# EAGLE design laser (EAGLE 9.6.2)

## Sheet 1 of 2
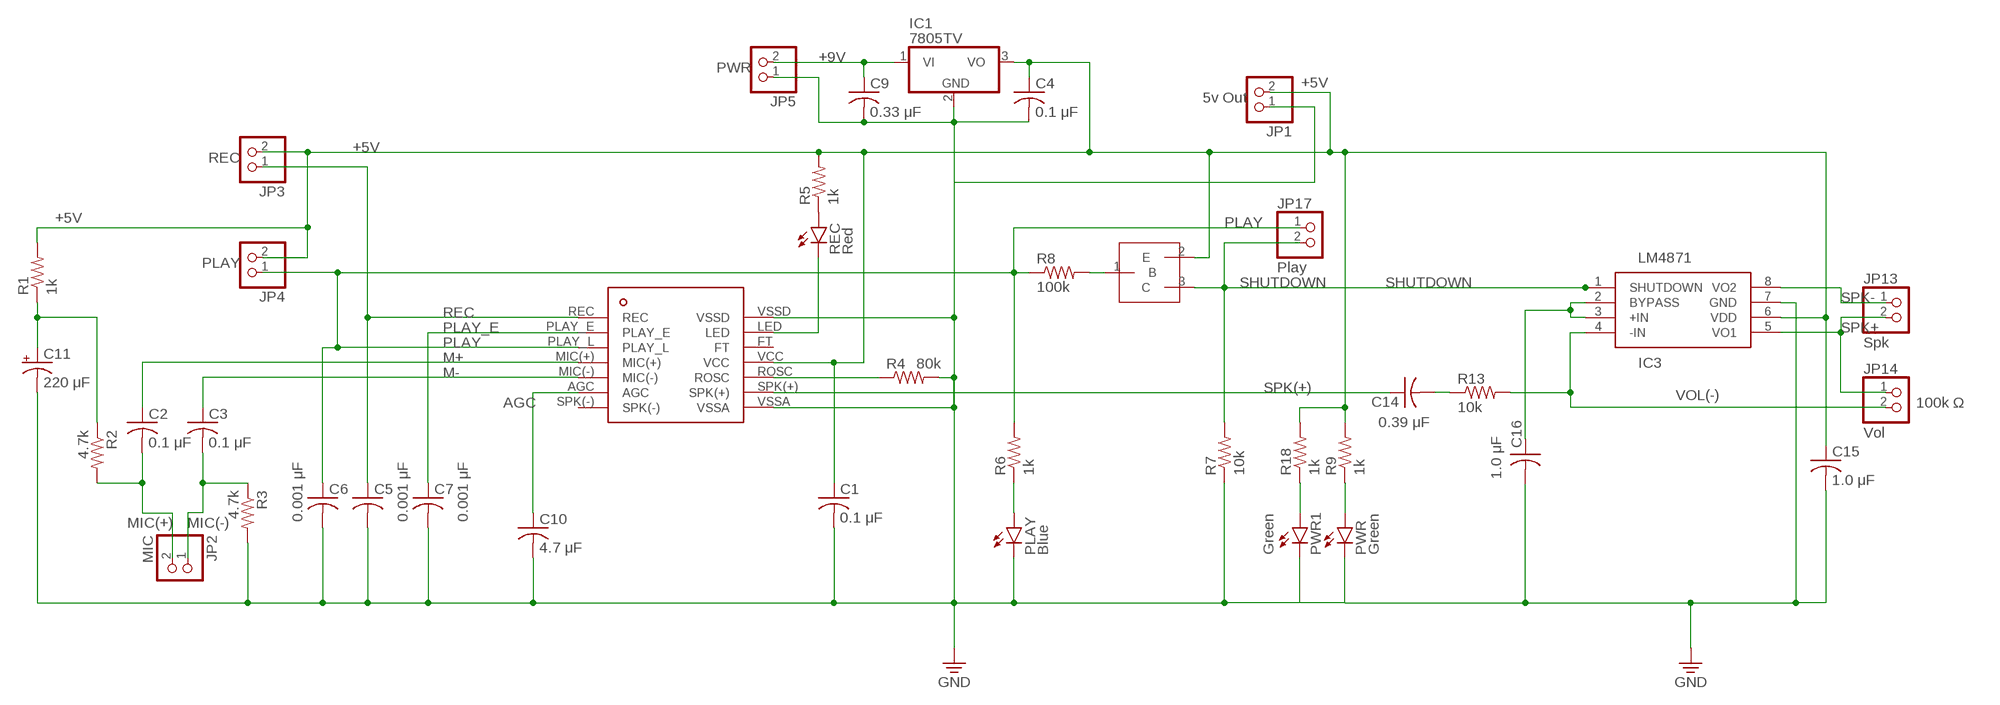
[diagram p0: schematic, sheet 1]

### Parts
C1  0.1 μF  C-USC0805  [C0805]
C2  0.1 μF  C-USC0805  [C0805]
C3  0.1 μF  C-USC0805  [C0805]
C4  0.1 μF  C-USC0805  [C0805]
C5  0.001 μF  C-USC0805  [C0805]
C6  0.001 μF  C-USC0805  [C0805]
C7  0.001 μF  C-USC0805  [C0805]
C9  0.33 μF  C-USC0805  [C0805]
C10  4.7 μF  C-USC0805  [C0805]
C11  220 μF  CPOL-USE2.5-5  [E2,5-5]
C14  0.39 μF  C-USC0805  [C0805]
C15  1.0 μF  C-USC0805  [C0805]
C16  1.0 μF  C-USC0805  [C0805]
IC1  7805TV  [TO220V]
IC3  LM4871  LM4871MX_NOPB  [SOIC127P600X175-8N]
JP1  5v Out  PINHD-1X2  [1X02]
JP2  MIC  PINHD-1X2  [1X02]
JP3  REC  PINHD-1X2  [1X02]
JP4  PLAY  PINHD-1X2  [1X02]
JP5  PWR  PINHD-1X2  [1X02]
JP13  Spk  PINHD-1X2  [1X02]
JP14  Vol  PINHD-1X2  [1X02]
JP17  Play  PINHD-1X2  [1X02]
PLAY  Blue  LEDCHIP-LED0805  [CHIP-LED0805]
PWR  Green  LEDCHIP-LED0805  [CHIP-LED0805]
PWR1  Green  LEDCHIP-LED0805  [CHIP-LED0805]
R1  1k  R-US_R0805  [R0805]
R2  4.7k  R-US_R0805  [R0805]
R3  4.7k  R-US_R0805  [R0805]
R4  80k  R-US_R0805  [R0805]
R5  1k  R-US_R0805  [R0805]
R6  1k  R-US_R0805  [R0805]
R7  10k  R-US_R0805  [R0805]
R8  100k  R-US_R0805  [R0805]
R9  1k  R-US_R0805  [R0805]
R13  10k  R-US_R0805  [R0805]
R18  1k  R-US_R0805  [R0805]
REC  Red  LEDCHIP-LED0805  [CHIP-LED0805]
U$1  ISD1820PY  [ISD1820PY]
U$2  PNP  2PB709ARL,235  [SOT95P230X110-3N]

### Nets
+5V: C1.1 C4.1 C15.1 IC1.3(VO) IC3.6(VDD) JP1.2 JP3.2 JP4.2 R1.2 R5.2 R9.2 R18.2 U$1.VCC U$2.2(E)
+9V: C9.1 IC1.1(VI) JP5.2
AGC: C10.1 U$1.AGC
GND: C1.2 C4.2 C5.2 C6.2 C7.2 C9.2 C10.2 C11.- C15.2 C16.2 IC1.2(GND) IC3.7(GND) JP1.1 JP5.1 PLAY.C PWR.C R3.2 R4.2 R7.1 U$1.VSSA U$1.VSSD ; also sheet 2
GND1: PWR1.C
M+: C2.1 U$1.MIC(+)
M-: C3.1 U$1.MIC(-)
MIC(+): C2.2 JP2.2 R2.2
MIC(-): C3.2 JP2.1 R3.1
N$1: PLAY.A R6.1
N$2: PWR.A R9.1
N$3: R8.2 U$2.1(B)
N$4: C14.2 R13.1
N$6: R4.1 U$1.ROSC
N$7: C16.1 IC3.2(BYPASS) IC3.3(+IN)
N$12: PWR1.A R18.1
N$13: C11.+ R1.1 R2.1
N$15: R5.1 REC.A
N$17: REC.C U$1.LED
PLAY: C6.1 JP4.1 JP17.1 R6.2 R8.1 U$1.PLAY_L ; also sheet 2
PLAY_E: C7.1 U$1.PLAY_E
REC: C5.1 JP3.1 U$1.REC
SHUTDOWN: IC3.1(SHUTDOWN) JP17.2 R7.2 U$2.3(C)
SPK(+): C14.1 U$1.SPK(+)
SPK+: IC3.5(VO1) JP13.2 JP14.1
SPK-: IC3.8(VO2) JP13.1
VOL(-): IC3.4(-IN) JP14.2 R13.2
Unconnected: U$1.FT U$1.SPK(-)

### Notes on the sheet
- 100k Ω ├

## Sheet 2 of 2
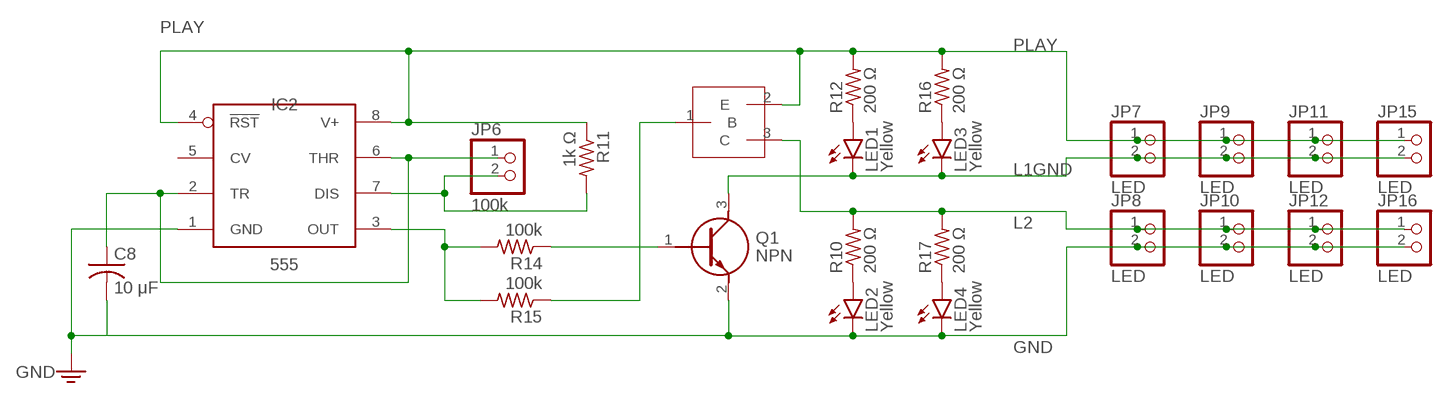
[diagram p1: schematic, sheet 2]

### Parts
C8  10 μF  C-US_CHIP-0805(2012-METRIC)  [CAPC2012X110]
IC2  555  NE555_SOIC  [SOIC127P599X175-8N]
JP6  100k  PINHD-1X2  [1X02]
JP7  LED  PINHD-1X2  [1X02]
JP8  LED  PINHD-1X2  [1X02]
JP9  LED  PINHD-1X2  [1X02]
JP10  LED  PINHD-1X2  [1X02]
JP11  LED  PINHD-1X2  [1X02]
JP12  LED  PINHD-1X2  [1X02]
JP15  LED  PINHD-1X2  [1X02]
JP16  LED  PINHD-1X2  [1X02]
LED1  Yellow  LEDCHIP-LED0805  [CHIP-LED0805]
LED2  Yellow  LEDCHIP-LED0805  [CHIP-LED0805]
LED3  Yellow  LEDCHIP-LED0805  [CHIP-LED0805]
LED4  Yellow  LEDCHIP-LED0805  [CHIP-LED0805]
Q1  NPN  PMBT2222A,215  [PMBT2222A215]
R10  200 Ω  R-US_M0805  [M0805]
R11  1k Ω  R-US_M0805  [M0805]
R12  200 Ω  R-US_M0805  [M0805]
R14  100k  R-US_M0805  [M0805]
R15  100k  R-US_M0805  [M0805]
R16  200 Ω  R-US_M0805  [M0805]
R17  200 Ω  R-US_M0805  [M0805]
U$3  PNP  2PB709ARL,235  [SOT95P230X110-3N]

### Nets
GND: C8.2 IC2.1(GND) JP8.2 JP10.2 JP12.2 JP16.2 LED2.C LED4.C Q1.2(E) ; also sheet 1
L1GND: JP7.2 JP9.2 JP11.2 JP15.2 LED1.C LED3.C Q1.3(C)
L2: JP8.1 JP10.1 JP12.1 JP16.1 R10.2 R17.2 U$3.3(C)
N$8: LED1.A R12.1
N$10: LED3.A R16.1
N$11: LED4.A R17.1
N$14: LED2.A R10.1
N$201: C8.1 IC2.2(TR) IC2.6(THR) JP6.1
N$202: IC2.3(OUT) R14.2 R15.2
N$203: Q1.1(B) R14.1
N$205: IC2.7(DIS) JP6.2 R11.2
N$208: R15.1 U$3.1(B)
PLAY: IC2.4(!RST) IC2.8(V+) JP7.1 JP9.1 JP11.1 JP15.1 R11.1 R12.2 R16.2 U$3.2(E) ; also sheet 1
Unconnected: IC2.5(CV)

## Library data of the parts
C1-C7 C9 C10 C14-C16 = rcl:C-US: CAPACITOR, American symbol; SPICEPREFIX: C
C8 = Capacitor:C-US: Capacitor - ANSI; CATEGORY: Capacitor
C11 = adafruit:CPOL-US: POLARIZED CAPACITOR, American symbol
IC1 = linear:78*: Positive VOLTAGE REGULATOR Source: http://cache.national.com/ds/LM/LM78L05.pdf http://www.fairchildsemi.com/ds/LM/LM7805.pdf
IC2 = IC_Clock-Timing:*555: TIMER 555 General purpose precision timers NE555 : Texas Datasheet <http://www.ti.com/general/docs/suppproductinfo.tsp?distId=10&gotoUrl=http%3A%2F%2Fwww.ti.com%2Flit%2Fgpn%2Fne555>, Diodes Incorporated Datasheet <https://www.diodes.com/assets/Datasheets/NE555_SA555_NA555.pdf> LM555 Datasheet <http://www.ti.com/general/docs/suppproductinfo.tsp?distId=10&gotoUrl=http%3A%2F%2Fwww.ti.com%2Flit%2Fgpn%2Flm555> LMC555 Datasheet <http://www.ti.com/general/docs/suppproductinfo.tsp?distId=10&gotoUrl=http%3A%2F%2Fwww.ti.com%2Flit%2Fgpn%2Flmc555> ICM7555 : Maxim Integrated Datasheet <https://datasheets.maximintegrated.com/en/ds/ICM7555-ICM7556.pdf>, Renesas Electronics America Inc Datasheet <https://www.renesas.com/en-us/www/doc/datasheet/icm7555-56.pdf>; CATEGORY: IC_Clock-Timing; CURRENT-SUPPLY: 10mA; DESCRIPTION: IC OSC SGL TIMER 100KHZ 8-SOIC; FREQUENCY: 100kHz; MANUFACTURER: Texas Instruments; MPN: NE555D; OPERATING_TEMP: 0°C to 70°C; PART_STATUS: Active; ROHS_COMPLIANT: ROHS3 Compliant; SUB-CATEGORY: Timer
IC3 = LM4871MX_NOPB:LM4871MX_NOPB: Boomer Series: 3W Audio Amplifier with Shutdown Mode Source: Datasheet <http://www.ti.com/lit/gpn/LM4871>; DESCRIPTION: Boomer Series: 3W Audio Amplifier with Shutdown Mode; HEIGHT: 1.75mm; MANUFACTURER_NAME: Texas Instruments; MANUFACTURER_PART_NUMBER: LM4871MX/NOPB; MOUSER_PART_NUMBER: 926-LM4871MX/NOPB; MOUSER_PRICE-STOCK: https://www.mouser.co.uk/ProductDetail/Texas-Instruments/LM4871MX-NOPB?qs=QbsRYf82W3EZ79z1jrjgtA%3D%3D
JP1-JP17 = pinhead:PINHD-1X2: PIN HEADER
LED1-LED4 PLAY PWR PWR1 REC = led:LED: LED OSRAM: - CHIPLED LG R971, LG N971, LY N971, LG Q971, LY Q971, LO R971, LY R971 LH N974, LH R974 LS Q976, LO Q976, LY Q976 LO Q996 - Hyper CHIPLED LW Q18S LB Q993, LB Q99A, LB R99A - SideLED LS A670, LO A670, LY A670, LG A670, LP A670 LB A673, LV A673, LT A673, LW A673 LH A674 LY A675 LS A676, LA A676, LO A676, LY A676, LW A676 LS A679, LY A679, LG A679 - Hyper Micro SIDELED® LS Y876, LA Y876, LO Y876, LY Y876 LT Y87S - SmartLED LW L88C, LW L88S LB L89C, LB L89S, LG L890 LS L89K, LO L89K, LY L89K LS L896, LA L896, LO L896, LY L896 - TOPLED LS T670, LO T670, LY T670, LG T670, LP T670 LSG T670, LSP T670, LSY T670, LOP T670, LYG T670 LG T671, LOG T671, LSG T671 LB T673, LV T673, LT T673, LW T673 LH T674 LS T676, LA T676, LO T676, LY T676, LB T676, LH T676, LSB T676, LW T676 LB T67C, LV T67C, LT T67C, LS T67K, LO T67K, LY T67K, LW E67C LS E67B, LA E67B, LO E67B, LY E67B, LB E67C, LV E67C, LT E67C LW T67C LS T679, LY T679, LG T679 LS T770, LO T770, LY T770, LG T770, LP T770 LB T773, LV T773, LT T773, LW T773 LH T774 LS E675, LA E675, LY E675, LS T675 LS T776, LA T776, LO T776, LY T776, LB T776 LHGB T686 LT T68C, LB T68C - Hyper Mini TOPLED® LB M676 - Mini TOPLED Santana® LG M470 LS M47K, LO M47K, LY M47K Source: http://www.osram.convergy.de LUXEON: - LUMILED® LXK2-PW12-R00, LXK2-PW12-S00, LXK2-PW14-U00, LXK2-PW14-V00 LXK2-PM12-R00, LXK2-PM12-S00, LXK2-PM14-U00 LXK2-PE12-Q00, LXK2-PE12-R00, LXK2-PE12-S00, LXK2-PE14-T00, LXK2-PE14-U00 LXK2-PB12-K00, LXK2-PB12-L00, LXK2-PB12-M00, LXK2-PB14-N00, LXK2-PB14-P00, LXK2-PB14-Q00 LXK2-PR12-L00, LXK2-PR12-M00, LXK2-PR14-Q00, LXK2-PR14-R00 LXK2-PD12-Q00, LXK2-PD12-R00, LXK2-PD12-S00 LXK2-PH12-R00, LXK2-PH12-S00 LXK2-PL12-P00, LXK2-PL12-Q00, LXK2-PL12-R00 Source: www.luxeon.com KINGBRIGHT: KA-3528ASYC Source: www.kingbright.com
Q1 = PMBT2222A_215:PMBT2222A,215: PMBT2222; PMBT2222A - NPN switching transistors Source: Datasheet <https://assets.nexperia.com/documents/data-sheet/PMBT2222A.pdf>; DESCRIPTION: PMBT2222; PMBT2222A - NPN switching transistors; HEIGHT: 1.1mm; MANUFACTURER_NAME: Nexperia; MANUFACTURER_PART_NUMBER: PMBT2222A,215; MOUSER_PART_NUMBER: 771-PMBT2222A-T/R; MOUSER_PRICE-STOCK: https://www.mouser.co.uk/ProductDetail/Nexperia/PMBT2222A215?qs=LOCUfHb8d9u7n2jbGrJFWg%3D%3D
R1-R18 = rcl:R-US_: RESISTOR, American symbol; SPICEPREFIX: R
U$1 = isd1820py:ISD1820PY
U$2 U$3 = 2PB709ARL,235-SOT23:2PB709ARL,235

## Board
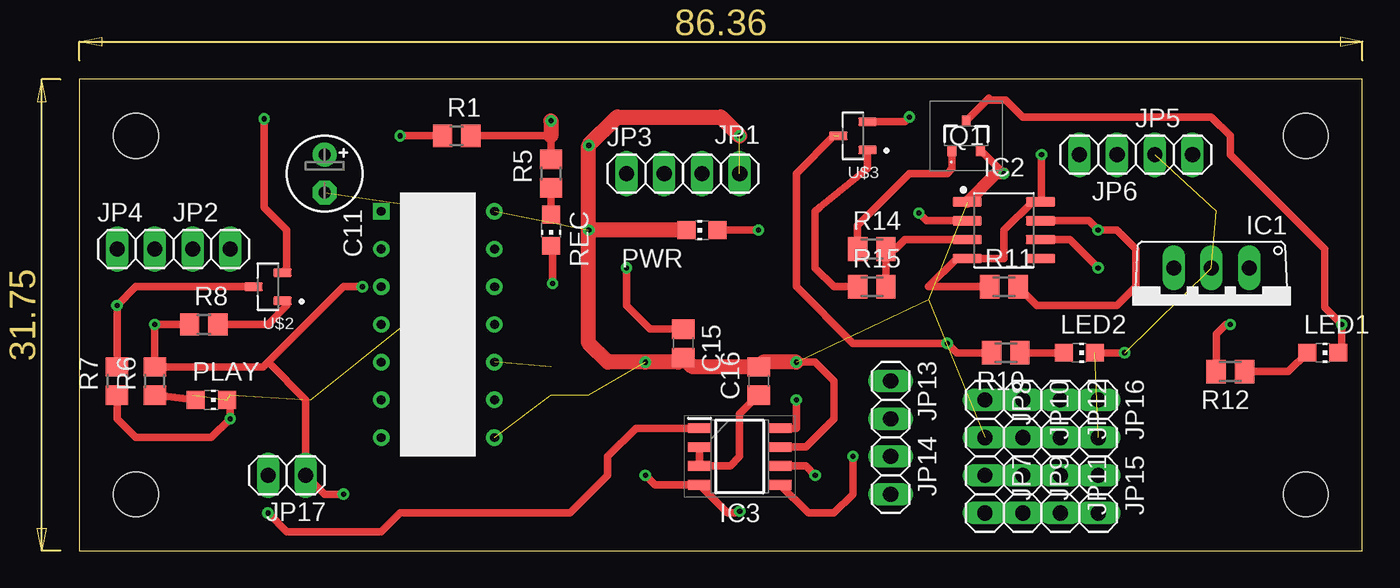
[diagram p2: board, top side]
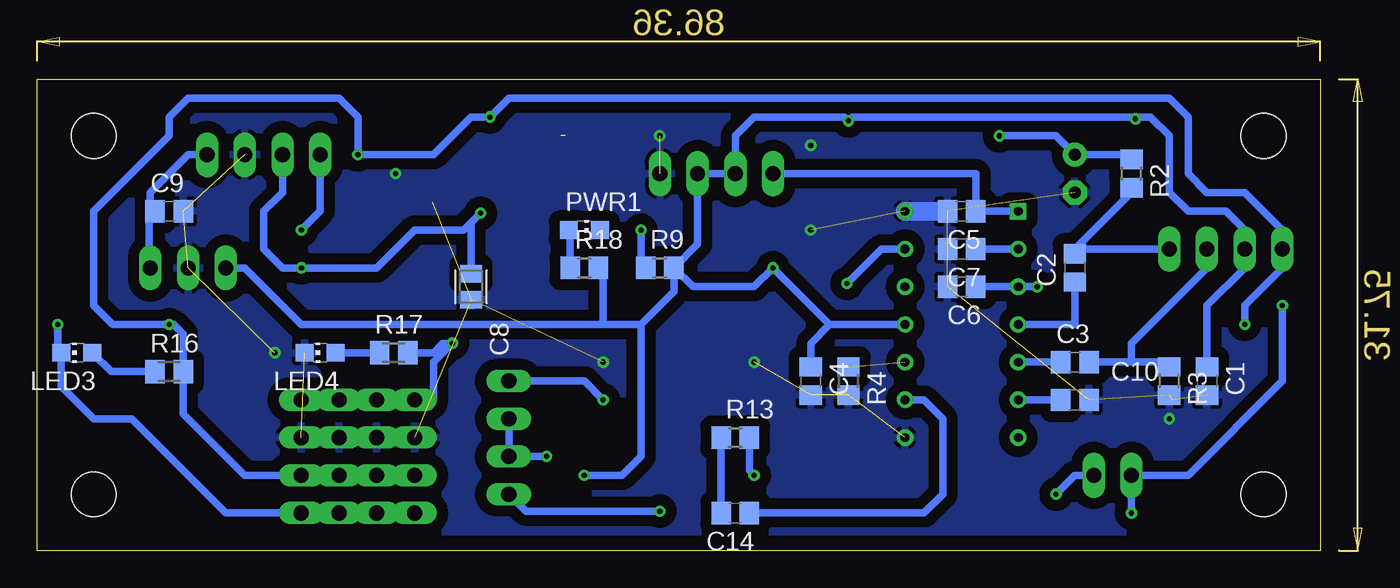
[diagram p3: board, bottom side, seen from below]

Size 86.36 x 31.75 mm. Coordinates in mm from the lower left corner, seen from the top.
Outline: 0,0 86.36,0 86.36,31.75 0,31.75 0,0
Copper layers (1*16): Top 0.035mm / dielectric 1.5mm / Bottom 0.035mm
Design rules "default": minimum track width 6mil, minimum drill 0.35mm, track to track 6mil, track to pad 6mil, pad to pad 6mil, via to via 6mil, smd to smd 6mil, copper to edge 40mil, drill to drill 6mil, minimum pad ring 10mil, minimum via ring 8mil, stop-mask expansion 4mil, vias tented up to drill 0mil, thermal gap 10mil
Holes 3 mm at 82.55,27.94 3.81,3.81 3.81,27.94 82.55,3.81
tKeepout: area 1.3,1.3 to 6.3,6.3; area 80,25.4 to 85,30.4; area 1.3,25.4 to 6.3,30.4; area 80,1.3 to 85,6.3

### Footprints (pad centres in the part's own frame; a part is rotated, then mirrored left to right if it is on the bottom)
C0805 = smd 1.3 x 1.5: 1 -0.95,0; 2 0.95,0
CAPC2012X110 = smd 1.165 x 1.465: 1 -0.875,0; 2 0.875,0
E2,5-5 = drill 0.813 pad 1.6: + -1.27,0 | drill 0.813 pad 1.6 octagon: - 1.27,0
TO220V = drill 1.016 long: 1 -2.54,-2.54; 2 0,-2.54; 3 2.54,-2.54
SOIC127P599X175-8N = smd 1.965 x 0.602: 1 -2.47,1.905; 2 -2.47,0.635; 3 -2.47,-0.635; 4 -2.47,-1.905; 5 2.47,-1.905; 6 2.47,-0.635; 7 2.47,0.635; 8 2.47,1.905
SOIC127P600X175-8N = smd 1.528 x 0.65: 1 -2.711,1.905; 2 -2.711,0.635; 3 -2.711,-0.635; 4 -2.711,-1.905; 5 2.711,-1.905; 6 2.711,-0.635; 7 2.711,0.635; 8 2.711,1.905
1X02 = drill 1.016 long: 1 -1.27,0; 2 1.27,0
CHIP-LED0805 = smd 1.2 x 1.2: A 0,-1.05; C 0,1.05
PMBT2222A215 = smd 0.6 x 0.7: 1 -0.95,-1; 2 0.95,-1; 3 0,1
R0805 = smd 1.3 x 1.5: 1 -0.95,0; 2 0.95,0
M0805 = smd 1.3 x 1.6: 1 -0.95,0; 2 0.95,0
ISD1820PY = drill 0.6: AGC -3.81,-5.08; FT 3.81,2.54; LED 3.81,5.08; MIC(+) -3.81,0; MIC(-) -3.81,-2.54; PLAY_E -3.81,5.08; PLAY_L -3.81,2.54; ROSC 3.81,-2.54; SPK(+) 3.81,-5.08; SPK(-) -3.81,-7.62; VCC 3.81,0; VSSA 3.81,-7.62; VSSD 3.81,7.62 | drill 0.6 square: REC -3.81,7.62
SOT95P230X110-3N = smd 1.26 x 0.59: 1 -0.98,0.95; 2 -0.98,-0.95; 3 0.98,0

### Placement (x,y rotation side)
C1  7.62,11.43 270 bottom
C2  16.51,19.05 90 bottom
C3  16.51,12.7 0 bottom
C4  34.29,11.43 270 bottom
C5  24.13,22.86 180 bottom
C6  24.13,17.78 180 bottom
C7  24.13,20.32 180 bottom
C8  57.15,17.78 270 bottom
C9  77.47,22.86 0 bottom
C10  16.51,10.16 0 bottom
C11  16.51,25.4 270 top
C14  39.37,2.54 180 bottom
C15  40.64,13.97 270 top
C16  45.72,11.43 90 top
IC1  76.2,16.51 180 top
IC2  62.23,21.59 0 top
IC3  44.45,6.35 0 top
JP1  43.18,25.4 180 top
JP2  8.89,20.32 0 top
JP3  38.1,25.4 0 top
JP4  3.81,20.32 0 top
JP5  73.66,26.67 0 top
JP6  68.58,26.67 180 top
JP7  60.96,3.81 270 top
JP8  60.96,8.89 270 top
JP9  63.5,3.81 270 top
JP10  63.5,8.89 270 top
JP11  66.04,3.81 270 top
JP12  66.04,8.89 270 top
JP13  54.61,10.16 270 top
JP14  54.61,5.08 270 top
JP15  68.58,3.81 270 top
JP16  68.58,8.89 270 top
JP17  13.97,5.08 180 top
LED1  83.69,13.34 270 top
LED2  67.31,13.34 270 top
LED3  83.69,13.34 90 bottom
LED4  67.31,13.34 90 bottom
PLAY  8.89,10.16 270 top
PWR  41.91,21.59 90 top
PWR1  49.53,21.59 270 bottom
Q1  59.69,27.94 0 top
R1  25.4,27.94 0 top
R2  12.7,25.4 270 bottom
R3  10.16,11.43 270 bottom
R4  31.75,11.43 270 bottom
R5  31.75,25.4 90 top
R6  5.08,11.43 90 top
R7  2.54,11.43 90 top
R8  8.38,15.24 0 top
R9  44.45,19.05 0 bottom
R10  62.36,13.34 180 top
R11  62.23,17.78 0 top
R12  77.47,12.06 180 top
R13  39.37,7.62 0 bottom
R14  53.34,20.32 0 top
R15  53.34,17.78 0 top
R16  77.47,12.06 0 bottom
R17  62.36,13.34 0 bottom
R18  49.53,19.05 0 bottom
REC  31.75,21.59 180 top
U$1  24.13,15.24 0 top
U$2  12.7,17.78 180 top
U$3  52.07,27.94 180 top

### Tracks (layer width: path | path; a pad name or v marks a point on that pad's centre or on a via)
+5V  (via drill 0.35)
  Top 0.508: R1.2 31.43,27.94 | 31.43,27.94 31.75,27.94 | 31.43,27.94 31.75,27.62 R5.2 | v12.45,29.09 12.45,23.11 13.97,21.59 13.97,19.02 U$2.2 | IC3.6 48.9,5.71 v49.53,5.08 | v36.83,19.05 36.83,16.51 38.42,14.92 C15.1
  Top 1.016: v31.75,28.96 31.75,27.94
  Bottom 0.508: U$1.VCC 33.02,15.24 | C1.1 7.62,16.51 5.08,19.05 JP4.2 5.08,21.59 6.35,22.86 8.89,22.86 10.16,24.13 10.16,27.94 11.43,29.21 12.32,29.21 v12.45,29.09 | v12.45,29.09 12.32,28.96 | v12.45,29.09 12.57,29.21 31.5,29.21 v31.75,28.96 32,29.21 38.1,29.21 39.37,27.94 JP3.2 JP1.2 41.91,20.64 R9.2 | C4.1 34.29,13.97 33.02,15.24 | v49.53,5.08 46.99,5.08 45.72,6.35 45.72,15.24 | R9.2 42.23,17.78 38.1,17.78 v36.83,19.05 33.02,15.24 | IC1.3 72.39,19.05 68.58,15.24 48.26,15.24 | 48.26,15.24 45.72,15.24 | 45.72,15.24 43.5,17.46 R9.2 | 48.26,15.24 48.26,18.73 R18.2
+9V
  Bottom 0.508: JP5.2 76.2,26.67 78.74,24.13 78.74,23.18 C9.1 78.8,22.48 78.8,19.11 IC1.1
AGC
  Bottom 0.508: C10.1 U$1.AGC
GND  (via drill 0.35)  (20 unrouted)
  Top 0.508: v48.26,12.7 49.53,12.7 50.8,11.43 50.8,8.89 48.9,6.99 IC3.7 | 46.04,12.7 C16.2 | v62.23,25.4 60.69,26.94 Q1.2 | R7.1 2.54,8.89 3.81,7.62 8.89,7.62 v10.16,8.89 10.16,9.94 PLAY.C | LED4.C v70.36,13.34
  Top 0.813: v62.23,25.4 61.66,25.4 IC2.1
  Top 1.016: v34.29,21.59 v34.29,27.3 36.2,29.21 43.18,29.21 v44.45,27.94 | v34.29,21.59 34.29,13.97 35.56,12.7 v38.1,12.7 40.32,12.7 C15.2 41.28,12.38 C16.2 | v48.26,12.7 46.04,12.7 | PWR.C v34.29,21.59
  Bottom 0.254: C6.2 25.4,17.78
  Bottom 0.508: JP8.2 JP10.2 JP12.2 JP16.2
  Bottom 1.27: U$1.VSSD C5.2
  pour Bottom (isolate 0.745): 0,0 0,31.75 86.36,31.75 86.36,0
L1GND  (via drill 0.35)
  Top 0.508: 61.23,30.48 61.09,30.34 | 61.09,30.34 Q1.3 | 61.09,30.34 62.37,30.34 63.5,29.21 76.2,29.21 77.47,27.94 77.47,26.67 83.82,20.32 83.82,16.38 v84.96,15.24 | v84.96,15.24 v84.97,15.24 | LED3.C 84.96,13.55 v84.96,15.24
  Bottom 0.508: JP7.2 JP9.2 JP11.2 JP15.2 73.66,2.54 80.01,8.89 82.55,8.89 84.74,11.08 LED3.C 84.97,13.56 v84.97,15.24
L2  (via drill 0.35)  (1 unrouted)
  Top 0.508: 50.8,27.94 48.26,25.4 48.26,17.78 52.07,13.97 v58.42,13.97 59.05,13.34 R10.2
  Bottom 0.508: JP16.1 JP12.1 JP10.1 JP8.1 59.69,10.16 59.69,12.7 v58.42,13.97 59.05,13.97 59.69,13.34 R10.2
M+
  Bottom 0.508: U$1.MIC(+) 16.51,15.24 C2.1
M-
  Bottom 0.508: U$1.MIC(-) C3.1
MIC(+)
  Bottom 0.508: C2.2 16.51,20.32 | R2.2 12.7,24.13 16.51,20.32 | JP2.2 16.51,20.32
MIC(-)
  Bottom 0.508: C3.2 12.7,12.7 | 12.7,12.7 10.48,12.7 R3.1 9.84,12.7 | 12.7,12.7 12.7,13.97 7.62,19.05 JP2.1
N$1
  Top 0.508: R6.1 PLAY.A
N$2  (via drill 0.35)
  Top 0.508: v45.72,21.59 PWR.A
  Bottom 0.508: R9.1 45.72,19.37 v45.72,21.59
N$3
  Top 0.508: 9.33,15.68 R8.2 12.7,15.24 13.97,16.51 13.97,16.54 U$2.1
N$4
  Bottom 0.508: R13.1 C14.2
N$6  (1 unrouted)
N$7
  Top 0.508: IC3.2 IC3.3 43.81,5.71 44.45,6.35 44.45,9.21 C16.1
N$8
  Top 0.508: R12.1 81.37,12.06 LED1.A
N$10
  Bottom 0.508: LED3.A 81.37,12.06 R16.1
N$11
  Bottom 0.508: R17.1 LED4.A
N$12
  Bottom 0.508: R18.1 50.48,21.49 PWR1.A
N$13  (via drill 0.35)
  Top 0.508: R1.1 v21.59,27.94
  Bottom 0.508: v21.59,27.94 17.78,27.94 C11.+ 13.02,26.67 R2.1
N$14
  Top 0.508: R10.1 LED2.A
N$15
  Top 0.508: R5.1 REC.A
N$17  (via drill 0.35)
  Top 0.508: 31.53,20.32 REC.C 31.85,20.44 v31.85,18
  Bottom 0.508: v31.85,18 29.53,20.32 U$1.LED
N$201  (via drill 0.35)
  Top 0.508: IC2.6 66.67,20.95 v68.58,19.05 | v56.52,22.73 57.02,22.23 IC2.2
  Bottom 0.508: JP6.1 69.85,24.13 71.12,22.86 71.12,20.32 69.85,19.05 v68.58,19.05 63.5,19.05 60.96,21.59 57.66,21.59 v56.52,22.73 57.15,22.1 C8.1
N$202
  Top 0.508: R15.2 R14.2 54.92,20.32 55.56,20.95 IC2.3
N$203
  Top 0.508: R14.1 52.39,21.91 55.88,25.4 58.42,25.4 58.74,25.72 Q1.1
N$205  (via drill 0.35)
  Top 0.508: IC2.7 67.94,22.23 v68.58,21.59 69.85,21.59 71.12,20.32 71.12,17.78 69.85,16.51 64.45,16.51 R11.2
  Bottom 0.508: v68.58,21.59 67.31,22.86 JP6.2
N$208
  Top 0.508: U$3.1 53.05,25.72 49.85,23.15 49.53,22.83 49.53,19.05 50.8,17.78 R15.1
PLAY  (via drill 0.35)
  Top 0.508: v19.05,17.78 17.78,17.78 12.7,12.7 | 7.3,15.11 R8.1 v5.08,15.24 R6.2 12.38,12.38 12.7,12.7 | R11.1 57.15,17.78 59.05,19.68 IC2.4 62.23,19.68 62.23,21.59 64.14,23.5 IC2.8 64.77,23.5 v64.77,26.67 | v55.88,29.21 55.56,28.89 U$3.2 | 76.58,12.13 R16.2 76.52,14.61 77.16,15.24 v77.47,15.24 | 12.7,12.7 15.24,10.16 JP17.1 16.51,3.81 v17.78,3.81
  Bottom 0.508: v19.05,17.78 U$1.PLAY_L C6.1 | v5.08,15.24 5.08,16.51 2.54,19.05 JP4.1 2.54,21.59 5.08,24.13 7.62,24.13 8.89,25.4 8.89,29.21 10.16,30.48 54.61,30.48 v55.88,29.21 57.15,29.21 59.69,26.67 v64.77,26.67 64.77,29.21 66.04,30.48 76.2,30.48 77.47,29.21 77.47,27.94 82.55,22.86 82.55,16.51 81.28,15.24 v77.47,15.24 77.16,15.24 76.52,14.61 R16.2 | JP17.1 16.51,5.08 v17.78,3.81 | JP7.1 JP9.1 JP11.1 JP15.1 72.39,5.08 76.52,9.21 R16.2 | R16.2 76.2,12.06
PLAY_E
  Bottom 0.508: U$1.PLAY_E C7.1
REC
  Bottom 0.508: U$1.REC C5.1 23.18,25.4 JP3.1
SHUTDOWN  (via drill 0.35)
  Top 0.508: U$2.3 3.81,17.78 v2.54,16.51 R7.2 | IC3.1 37.47,8.26 35.56,6.35 35.56,5.08 33.02,2.54 21.59,2.54 20.32,1.27 13.97,1.27 v12.7,2.54
  Bottom 0.508: v2.54,16.51 2.54,11.43 8.89,5.08 JP17.2 v12.7,2.54
SPK(+)
  Bottom 0.508: C14.1 26.67,2.54 25.4,3.81 25.4,8.89 26.67,10.16 U$1.SPK(+)
SPK+  (via drill 0.35)
  Top 0.508: IC3.5 49.07,2.54 50.8,2.54 52.07,3.81 v52.07,6.35
  Bottom 0.508: v52.07,6.35 JP14.1 JP13.2
SPK-  (via drill 0.35)
  Top 0.508: IC3.8 48.26,8.26 v48.26,10.16
  Bottom 0.508: v48.26,10.16 49.53,11.43 JP13.1
VOL(-)  (via drill 0.35)
  Top 0.508: v38.1,5.08 38.73,4.45 IC3.4 43.64,2.54 44.45,2.54 v44.45,2.66
  Bottom 0.508: R13.2 38.42,5.4 v38.1,5.08 | v44.45,2.66 53.46,2.66 JP14.2

### Text on the board
tValues: pot